# EAGLE schematic SMART_PJU (EAGLE 9.6.2)

## Sheet 1 of 2
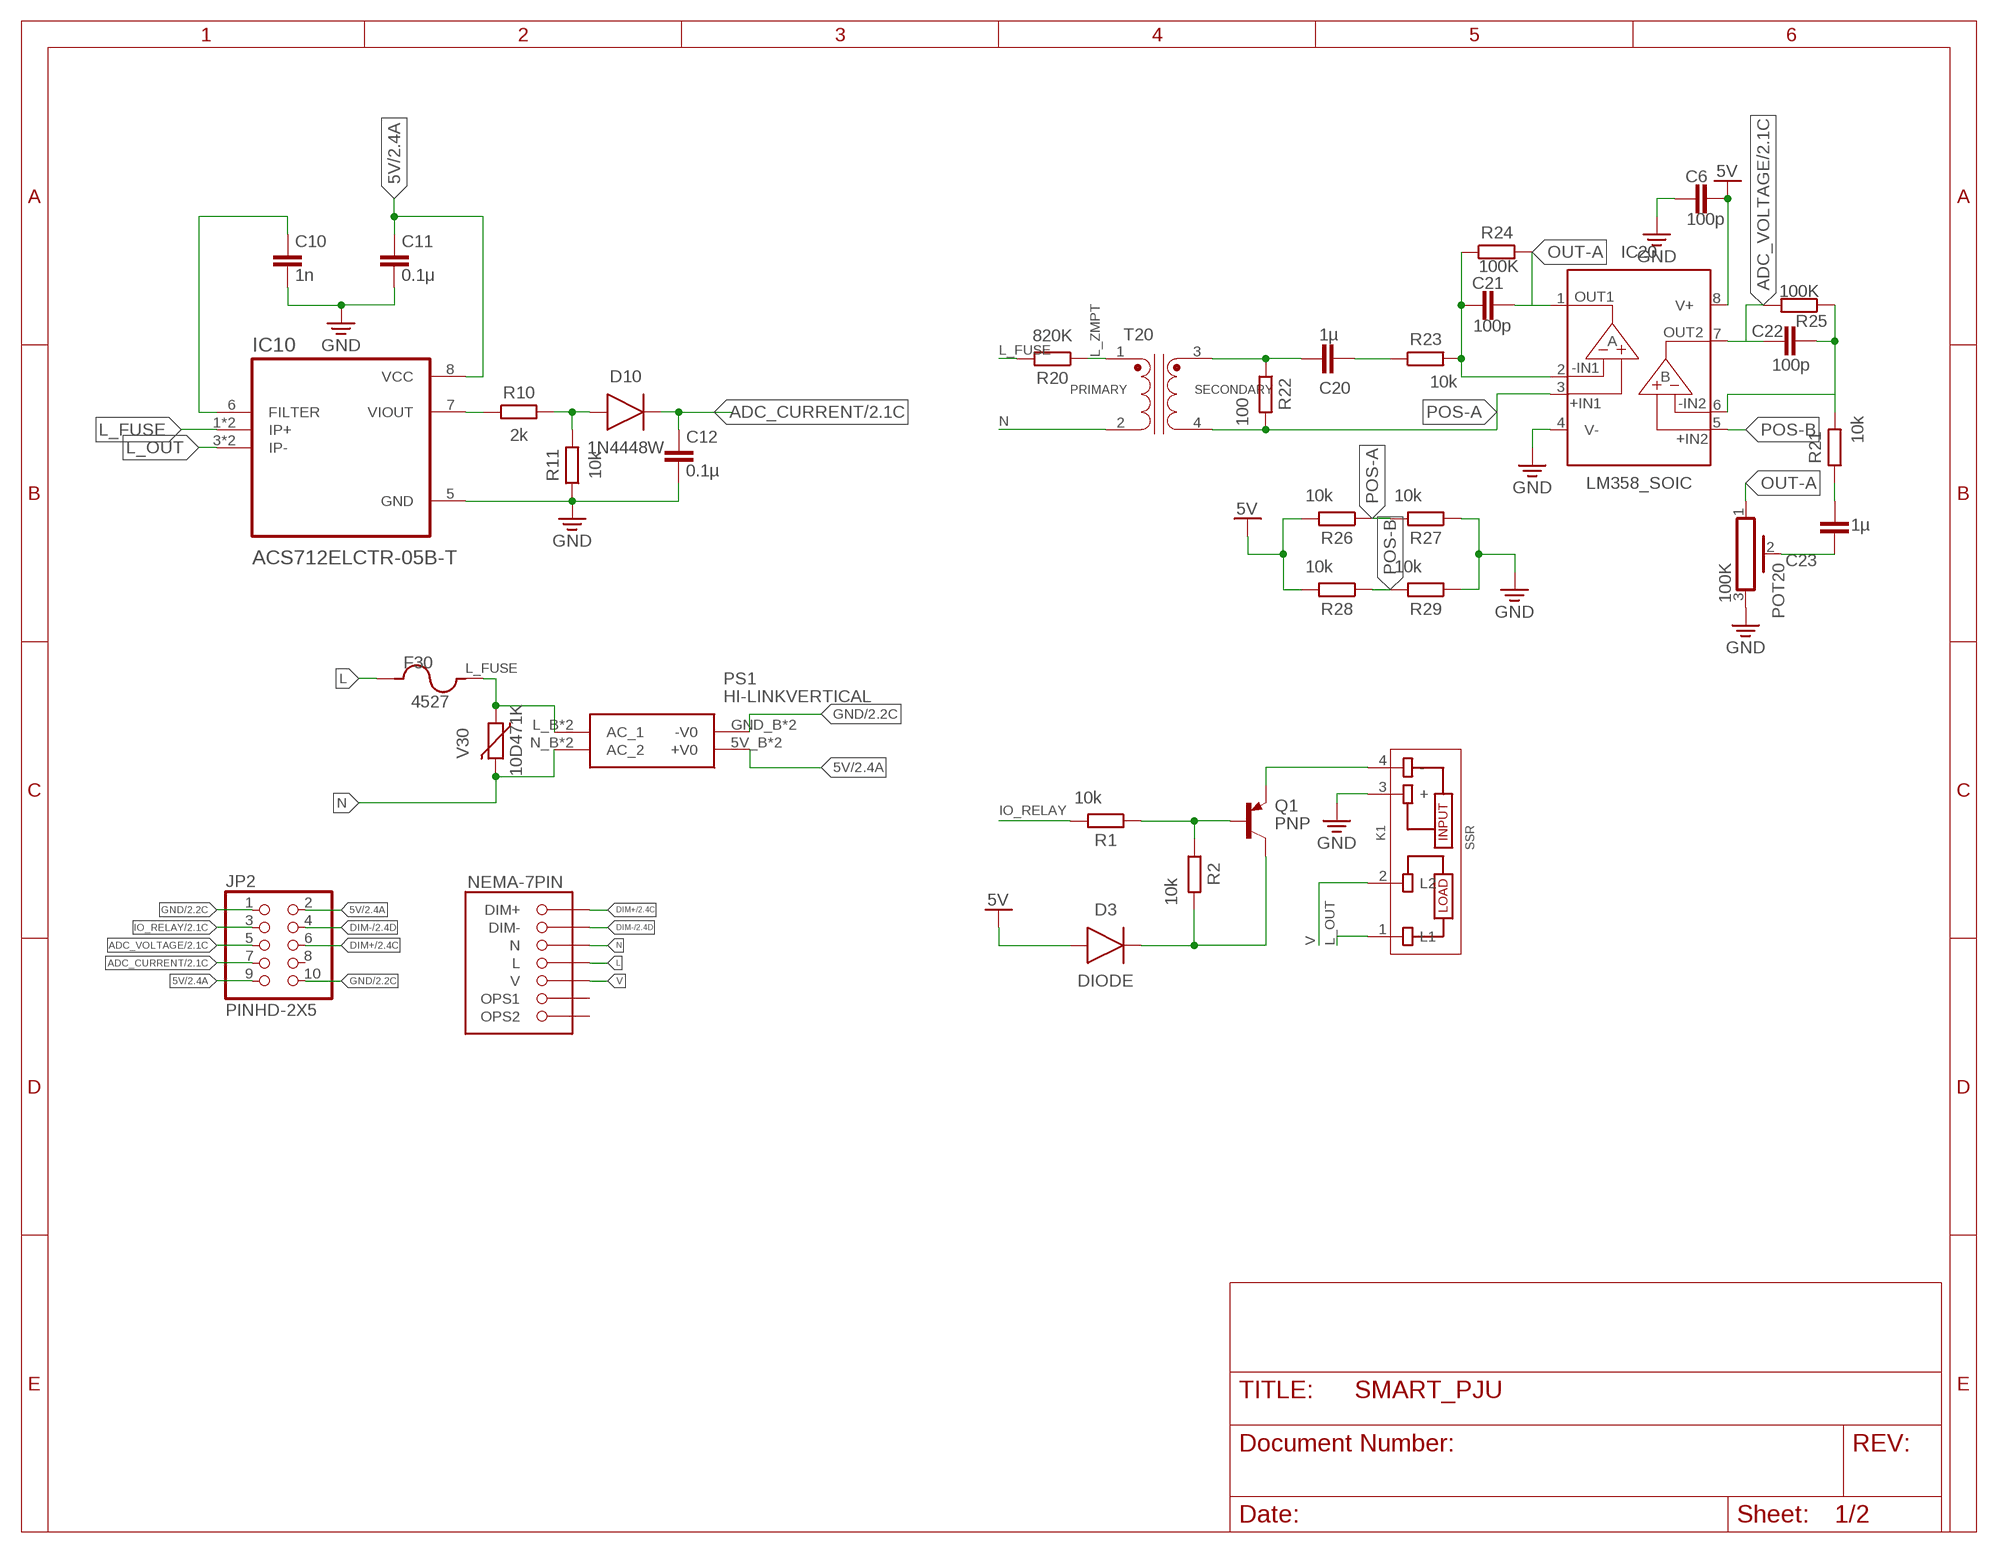
[diagram p0: schematic, sheet 1]

### Parts
C6  100p  C_CHIP-0603(1608-METRIC)  [CAPC1608X85]
C10  1n  C_CHIP-0603(1608-METRIC)  [CAPC1608X85]
C11  0.1μ  C_CHIP-0603(1608-METRIC)  [CAPC1608X85]
C12  0.1µ  C_CHIP-0603(1608-METRIC)  [CAPC1608X85]
C20  1µ  C_CHIP-0603(1608-METRIC)  [CAPC1608X85]
C21  100p  C_CHIP-0603(1608-METRIC)  [CAPC1608X85]
C22  100p  C_CHIP-0603(1608-METRIC)  [CAPC1608X85]
C23  1µ  C_CHIP-0603(1608-METRIC)  [CAPC1608X85]
D3  DIODE  DIODEDO-214AC(SMA)  [DIOM5226X290N]
D10  1N4448W  DIODE_1N4148W-7-F_SOD123G  [SOD3715X135]
F30  4527  [4527]
IC10  ACS712ELCTR-05B-T  [SOIC127P600X175-8N@1]
IC20  LM358_SOIC  [SOIC127P600X175-8N]
JP2  PINHD-2X5  [2X05]
K1  SSR  [SSR_G3MB-202P]
NEMA-7PIN  NEMA-7P  [NEMA-7P]
POT20  100K  PV36W  [PV36W]
PS1  HI-LINKVERTICAL  [AC-DC_3.5W(VER)]
Q1  PNP  PNP_SOT23-BEC  [SOT95P237X112-3N]
R1  10k  R_CHIP-0603(1608-METRIC)  [RESC1608X60]
R2  10k  R_CHIP-0603(1608-METRIC)  [RESC1608X60]
R10  2k  R_CHIP-0603(1608-METRIC)  [RESC1608X60]
R11  10k  R_CHIP-0603(1608-METRIC)  [RESC1608X60]
R20  820K  R-EU_R0805  [R0805]
R21  10k  R_CHIP-0603(1608-METRIC)  [RESC1608X60]
R22  100  R-EU_R1206  [R1206]
R23  10k  R_CHIP-0603(1608-METRIC)  [RESC1608X60]
R24  100K  R_CHIP-0603(1608-METRIC)  [RESC1608X60]
R25  100K  R_CHIP-0603(1608-METRIC)  [RESC1608X60]
R26  10k  R_CHIP-0603(1608-METRIC)  [RESC1608X60]
R27  10k  R_CHIP-0603(1608-METRIC)  [RESC1608X60]
R28  10k  R_CHIP-0603(1608-METRIC)  [RESC1608X60]
R29  10k  R_CHIP-0603(1608-METRIC)  [RESC1608X60]
T20  ZMPT101B  [ZMPT101B]
V30  10D471K  VARISTOR  [MOV-10D561]

### Nets
5V: C6.2 C11.1 D3.2(A) IC10.8(VCC) IC20.8(V+) JP2.2 JP2.9 PS1.5V_B(+V0) PS1.5V_T(+V0) R26.2 R28.2 ; also sheet 2
ADC_CURRENT: C12.1 D10.1(C) JP2.7 ; also sheet 2
ADC_VOLTAGE: JP2.5 R25.2 ; also sheet 2
DIM+: JP2.6 NEMA-7PIN.DIM+ ; also sheet 2
DIM-: JP2.4 NEMA-7PIN.DIM- ; also sheet 2
GND: C6.1 C10.2 C11.2 C12.2 IC10.5(GND) IC20.4(V-) JP2.1 JP2.10 K1.3(+) POT20.3 PS1.GND_B(-V0) PS1.GND_T(-V0) R11.1 R27.1 R29.1 ; also sheet 2
IO_RELAY: JP2.3 R1.2 ; also sheet 2
L: F30.1 NEMA-7PIN.L
L_FUSE: F30.2 IC10.1(IP+) IC10.2(IP+) PS1.L_B(AC_1) PS1.L_T(AC_1) R20.2 V30.1
L_OUT: IC10.3(IP-) IC10.4(IP-) K1.1(L1)
L_ZMPT: R20.1 T20.1
N: NEMA-7PIN.N PS1.N_B(AC_2) PS1.N_T(AC_2) T20.2 V30.2
N$1: C20.1 R22.1 T20.3
N$2: C21.2 IC20.1(OUT1)
N$3: C20.2 R23.1
N$4: IC10.7(VIOUT) R10.1
N$7: C22.1 IC20.7(OUT2)
N$8: C21.1 IC20.2(-IN1) R23.2 R24.1
N$9: D10.2(A) R10.2 R11.2
N$11: C10.1 IC10.6(FILTER)
N$12: D3.1(C) Q1.3(C) R2.2
N$13: Q1.1(B) R1.1 R2.1
N$15: K1.4(-) Q1.2(E)
N$16: C22.2 IC20.6(-IN2) R21.2 R25.1
N$17: C23.2 R21.1
N$18: C23.1 POT20.2
OUT-A: POT20.1 R24.2
POS-A: IC20.3(+IN1) R22.2 R26.1 R27.2 T20.4
POS-B: IC20.5(+IN2) R28.1 R29.2
V: K1.2(L2) NEMA-7PIN.V
Unconnected: JP2.8 NEMA-7PIN.OPS1 NEMA-7PIN.OPS2

## Sheet 2 of 2
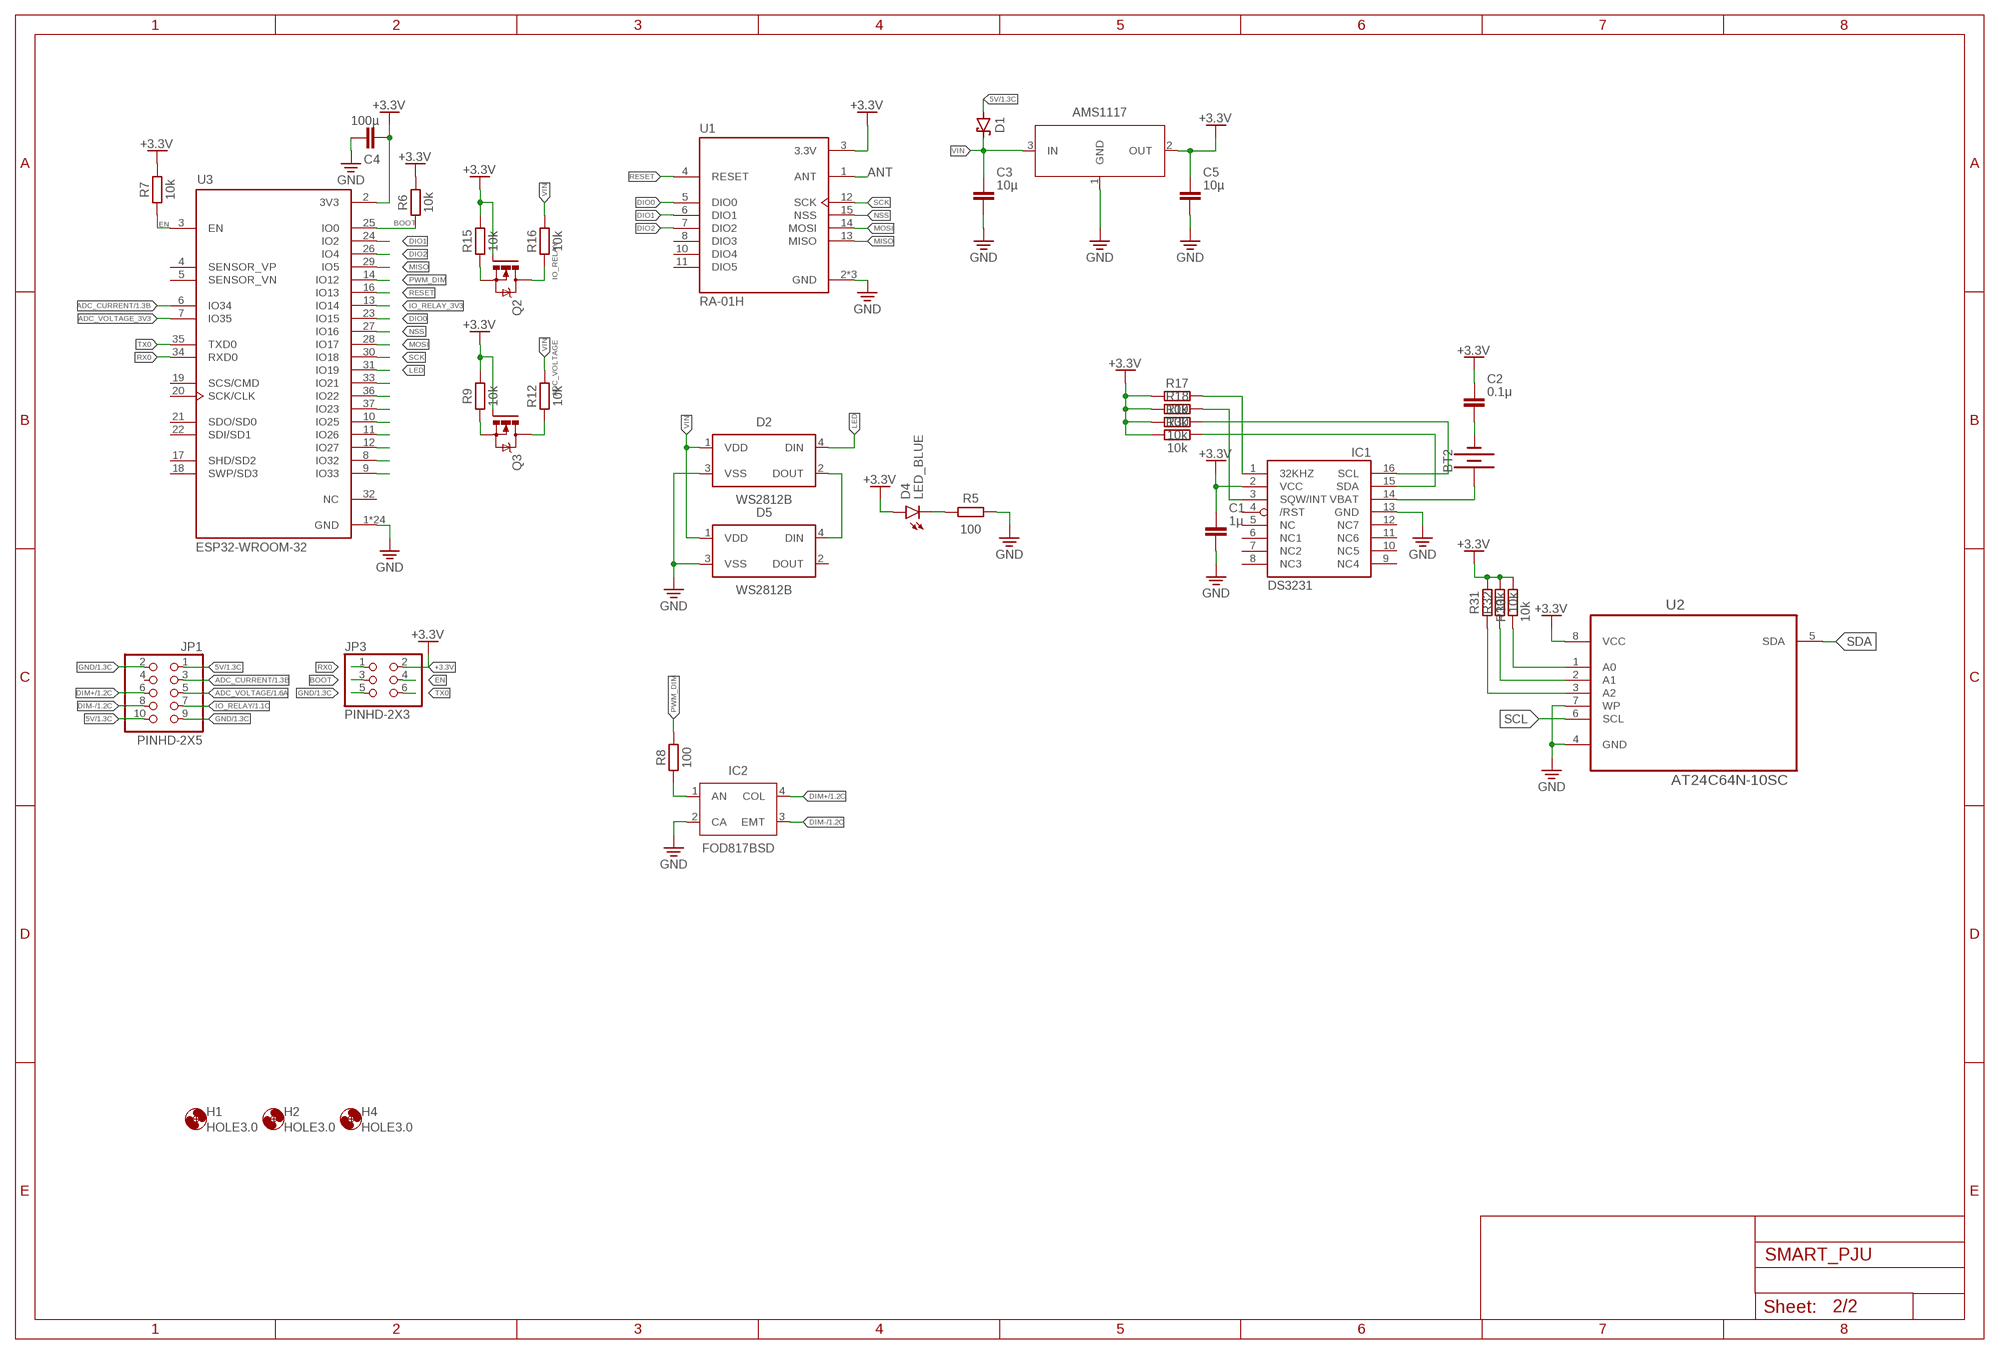
[diagram p1: schematic, sheet 2]

### Parts
AMS1117  NCP1117ST33T3G  NCP1117ST33T3GSOT-223  [SOT230P700X170-4]
BT2  BATTERY-20MM_PTH  [BATTCOM_20MM_PTH]
C1  1μ  C_CHIP-0603(1608-METRIC)  [CAPC1608X85]
C2  0.1μ  C_CHIP-0603(1608-METRIC)  [CAPC1608X85]
C3  10µ  C_CHIP-0603(1608-METRIC)  [CAPC1608X85]
C4  100µ  C_TANTALUM-2412(6032-METRIC)  [CAPM6032X280]
C5  10µ  C_CHIP-0603(1608-METRIC)  [CAPC1608X85]
D1  MBR0520LT1G  SCHOTTKY_MBR0520LT1GDO-219  [SODFL3718X115]
D2  WS2812B  [WS2812B]
D4  LED_BLUE  CHIP-FLAT-B_0603-0.55MM  [LEDC1608X55N_FLAT-B]
D5  WS2812B  [WS2812B]
H1  HOLE3.0  MOUNT-HOLE3.0  [3,0]
H2  HOLE3.0  MOUNT-HOLE3.0  [3,0]
H4  HOLE3.0  MOUNT-HOLE3.0  [3,0]
IC1  DS3231/SO  [SO16W]
IC2  FOD817BSD  FOD817BSDSMT  [DIP1016W60P279L460H460Q4B]
JP1  PINHD-2X5  [2X05]
JP3  PINHD-2X3  [2X03]
Q2  NMOSFET  NMOSFETSOT23-GSD  [SOT23]
Q3  NMOSFET  NMOSFETSOT23-GSD  [SOT23]
R5  100  R_CHIP-0603(1608-METRIC)  [RESC1608X60]
R6  10k  R_CHIP-0603(1608-METRIC)  [RESC1608X60]
R7  10k  R_CHIP-0603(1608-METRIC)  [RESC1608X60]
R8  100  R_CHIP-0603(1608-METRIC)  [RESC1608X60]
R9  10k  R_CHIP-0603(1608-METRIC)  [RESC1608X60]
R12  10k  R_CHIP-0603(1608-METRIC)  [RESC1608X60]
R15  10k  R_CHIP-0603(1608-METRIC)  [RESC1608X60]
R16  10k  R_CHIP-0603(1608-METRIC)  [RESC1608X60]
R17  10k  R-EU_R1206  [R1206]
R18  10k  R-EU_R1206  [R1206]
R19  10k  R-EU_R1206  [R1206]
R30  10k  R-EU_R1206  [R1206]
R31  10k  R-EU_R1206  [R1206]
R32  10k  R-EU_R1206  [R1206]
R33  10k  R-EU_R1206  [R1206]
U1  RA-01H  [RA-01H]
U2  AT24C64N-10SC  [SOIC127P600X175-8N]
U3  ESP32-WROOM-32  [MODULE_ESP32-WROOM-32]

### Nets
5V: D1.2(A) JP1.1 JP1.10 ; also sheet 1
+3.3V: AMS1117.2(OUT) C1.1 C2.1 C4.1 C5.1 D4.A IC1.2(VCC) JP3.2 Q2.1(G) Q3.1(G) R6.2 R7.2 R9.2 R15.2 R17.1 R18.1 R19.1 R30.1 R31.2 R32.2 R33.2 U1.3(3.3V) U2.8(VCC) U3.2(3V3)
ADC_CURRENT: JP1.3 U3.6(IO34) ; also sheet 1
ADC_VOLTAGE: JP1.5 Q3.3(D) R12.1 ; also sheet 1
ADC_VOLTAGE_3V3: Q3.2(S) R9.1 U3.7(IO35)
ANT: U1.1(ANT)
BOOT: JP3.3 R6.1 U3.25(IO0)
DIM+: IC2.4(COL) JP1.6 ; also sheet 1
DIM-: IC2.3(EMT) JP1.8 ; also sheet 1
DIO0: U1.5(DIO0) U3.23(IO15)
DIO1: U1.6(DIO1) U3.24(IO2)
DIO2: U1.7(DIO2) U3.26(IO4)
EN: JP3.4 R7.1 U3.3(EN)
GND: C1.2 C3.2 C4.2 C5.2 D2.3(VSS) D5.3(VSS) IC1.13(GND) IC2.2(CA) JP1.2 JP1.9 JP3.5 R5.2 U1.2(GND) U1.9(GND) U1.16(GND) U2.4(GND) U2.7(WP) U3.1(GND) U3.15(GND) U3.38(GND) U3.39_1(GND) U3.39_2(GND) U3.39_3(GND) U3.39_4(GND) U3.39_5(GND) U3.39_6(GND) U3.39_7(GND) U3.39_8(GND) U3.39_9(GND) U3.39_10(GND) U3.39_11(GND) U3.39_12(GND) U3.39_13(GND) U3.39_14(GND) U3.39_15(GND) U3.39_16(GND) U3.39_17(GND) U3.39_18(GND) U3.39_19(GND) U3.39_20(GND) U3.39_21(GND) ; also sheet 1
IO_RELAY: JP1.7 Q2.3(D) R16.1 ; also sheet 1
IO_RELAY_3V3: Q2.2(S) R15.1 U3.13(IO14)
LED: D2.4(DIN) U3.31(IO19)
MISO: U1.13(MISO) U3.29(IO5)
MOSI: U1.14(MOSI) U3.28(IO17)
N$5: R33.1 U2.1(A0)
N$6: R32.1 U2.2(A1)
N$10: R31.1 U2.3(A2)
N$14: D2.2(DOUT) D5.4(DIN)
N$19: BT2.1(+) IC1.14(VBAT)
N$20: IC1.3(SQW/INT) R18.2
N$21: IC1.1(32KHZ) R17.2
N$23: BT2.2(-) C2.2
N$25: D4.C R5.1
N$26: IC2.1(AN) R8.1
N$33: AMS1117.1(GND) ; supply symbol labelled GND
N$39: U3.33(IO21)
N$40: U3.36(IO22)
N$41: U3.37(IO23)
N$42: U3.10(IO25)
N$43: U3.11(IO26)
N$44: U3.12(IO27)
N$45: U3.8(IO32)
N$46: U3.9(IO33)
NSS: U1.15(NSS) U3.27(IO16)
PWM_DIM: R8.2 U3.14(IO12)
RESET: U1.4(RESET) U3.16(IO13)
RX0: JP3.1 U3.34(RXD0)
SCK: U1.12(SCK) U3.30(IO18)
SCL: IC1.16(SCL) R19.2 U2.6(SCL)
SDA: IC1.15(SDA) R30.2 U2.5(SDA)
TX0: JP3.6 U3.35(TXD0)
VIN: AMS1117.3(IN) C3.1 D1.1(C) D2.1(VDD) D5.1(VDD) R12.2 R16.2
Unconnected: D5.2(DOUT) IC1.4(/RST) IC1.5(NC) IC1.6(NC1) IC1.7(NC2) IC1.8(NC3) IC1.9(NC4) IC1.10(NC5) IC1.11(NC6) IC1.12(NC7) JP1.4 U1.8(DIO3) U1.10(DIO4) U1.11(DIO5) U3.4(SENSOR_VP) U3.5(SENSOR_VN) U3.17(SHD/SD2) U3.18(SWP/SD3) U3.19(SCS/CMD) U3.20(SCK/CLK) U3.21(SDO/SD0) U3.22(SDI/SD1) U3.32(NC)

## Library data of the parts
AMS1117 = IC_Power-Management:NCP1117ST33T3G: 1.0 A Low-Dropout Positive Fixed and Adjustable Voltage Regulators Datasheet <https://www.onsemi.com/pub/Collateral/NCP1117-D.PDF>; CATEGORY: IC_Power-Management; MANUFACTURER: ON Semiconductor; MPN: NCP1117ST33T3G; OPERATING_TEMP: 0 to +125 °C; PART_STATUS: Active; ROHS_COMPLIANT: RoHS3 Compliant; SERIES: NCP1117, NCV1117; SUB-CATEGORY: Voltage Regulator; TYPE: Linear
BT2 = SparkFun-Batteries:BATTERY: Battery - Single Cell A variety of battery chemistries, sizes, and footprints. Device List: 20MM_PTH - Coin Cell Battery Holder - 20mm (PTH) <https://www.sparkfun.com/products/783> 20MM_PTH_KIT- Coin Cell battery Holder - 20 mm (PTH) <http://www.sparkfun.com/products/783>kit version with special mask 6.8MM_PTH - Coin Cell Battery Holder - 6.8MM(SMD) <https://www.digikey.com/product-detail/en/seiko-instruments/MS621FE-FL11E/728-1057-ND/1889208?WT.srch=1&gclid=CNOQ5a6LzdQCFZS2wAodXCkE0g> 12MM_SMD - Coin Cell Battery Holder - 12mm (SMD) <https://www.sparkfun.com/products/10592> 12MM_PTH - Coin Cell Battery Holder - 12mm (PTH) <https://www.sparkfun.com/products/7948> 20MM_SMD - 20mm Coin Cell Battery Holder (SMD) (2 legs) Used on the Big Time Watch Kit <https://www.sparkfun.com/products/11734> 20MM_SMD_4LEGS - Coin Cell Battery Holder - 20mm (SMD) <https://www.sparkfun.com/products/11892> 20MM_SMD_4LEGS_OVERPASTE - Coin Cell Battery Holder - 20mm (SMD) <https://www.sparkfun.com/products/11892> (Over-paste on the legs) 24.5MM_PTH - Coin Cell Battery Holder - 24.5mm (PTH) <https://www.sparkfun.com/products/8863> 9V - 9V Battery Holder - PC Mount Used on the SparkFun SparkPunk Sound Kit <https://www.sparkfun.com/products/11177> and SparkFun SparkPunk Sequencer Kit <https://www.sparkfun.com/products/12707> 18650 - Battery Holder - 18650 (PTH) <https://www.sparkfun.com/products/13113> AA - Battery Holder - 1xAA (PTH) <https://www.sparkfun.com/products/7949> AAA - Battery Holder - 1xAAA (PTH) <https://www.sparkfun.com/products/12718> AA_KIT - Battery Holder - 1xAA (PTH) <https://www.sparkfun.com/products/7949> Special kit package - pads only have exposed copper on one side of the board. AAA_KIT - Battery Holder - 1xAAA (PTH) <https://www.sparkfun.com/products/12718> Special kit package - pads only have exposed copper on one side of the board.; PROD_ID: BATT-09031; SF_SKU: PRT-00783
C1-C6 C10-C12 C20-C23 = Capacitor:C: Capacitor - Generic; CATEGORY: Capacitor
D1 = Diode:SCHOTTKY_: Schottky Diode - Popular parts; CATEGORY: Diode; DESCRIPTION: DIODE SCHOTTKY 20V 500MA SOD123; MANUFACTURER: ON Semiconductor; MPN: MBR0520LT1G; SUB-CATEGORY: Schottky
D2 D5 = LED:WS2812B: Intelligent control LED integrated light source Datasheet <http://cdn.sparkfun.com/datasheets/BreakoutBoards/WS2812B.pdf>; CATEGORY: LED; COLOR: RGB; DESCRIPTION: LED integrated light source; MANUFACTURER: Worldsemi; MPN: WS2812B; OPERATING_TEMP: -25 ℃ to +80℃(TJ); PART_STATUS: Active; SUB_CATEGORY: RGB
D3 = Diode:DIODE: Diode Rectifier - Generic; CATEGORY: Diode; SUB-CATEGORY: Rectifier
D4 = LED:CHIP-FLAT-B; CATEGORY: LED; COLOR: BLUE; DESCRIPTION: CHIP LED FLAT; SUB-CATEGORY: CHIP; TYPE: FLAT_TOP
D10 = Diode:DIODE_: Diode Rectifier - Popular parts; CATEGORY: Diode; DESCRIPTION: DIODE GEN PURP 100V 300MA SOD123; MANUFACTURER: Diodes Incorporated; SUB-CATEGORY: Rectifier; VALUE: 1N4148W
F30 = Fuse Holder:4527: FUSE HLDR CARTRIDGE 250V 5A PCB Manufacturer's datasheet <https://www.keyelco.com/userAssets/file/M65p44.pdf>; CREATED_BY: PCBLayout.com; DIGIKEY_PN: 36-4527-ND; MANUFACTURER: Keystone Electronics; MPN: 4527
H1 H2 H4 = holes:MOUNT-HOLE: MOUNTING HOLE with drill center marker
IC1 = XLKM#4:DS3231
IC2 = Opto-Electronic:FOD817BSD: 4-Pin DIP Phototransistor Optocouplers; CATEGORY: Opto-Electronic; MANUFACTURER: ON Semiconductor; MPN: FOD817BSD; OPERATING_TEMP: -55 to +110 °C; PART_STATUS: Active; ROHS_COMPLIANT: RoHS3 Compliant; SUB-CATEGORY: OptoCoupler; THERMALLOSS: 0.2W
IC10 = XLKM#4:ACS712ELCTR-05B-T
IC20 = IC_Linear:LM358: Dual Operational Amplifier Reference Datasheet <https://www.ti.com/lit/ds/symlink/lm158-n.pdf>; CATEGORY: Amplifier; DESCRIPTION: Dual Operational Amplifier; MANUFACTURER: Generic; MPN: Generic; SERIES: LM358; SUB-CATEGORY: OpAmp; TYPE: Dual
JP1 JP2 = Connector:PINHD-2X5: PIN HEADER; CATEGORY: CONNECTOR; SUB-CATEGORY: PIN-HEADER
JP3 = Connector:PINHD-2X3: PIN HEADER; CATEGORY: CONNECTOR; SUB-CATEGORY: PIN-HEADER
K1 = XLKM#4:SSR: Relay 12vdc Isolation Photot; MANUFACTURER: Omron; PARTREV: N/A; STANDARD: Manufacturer Recommendation
NEMA-7PIN = XLKM#4:NEMA-7P
POT20 = Resistor:PV36: Rectangular Trimmer Potentiometers - PV36 Series Datasheet <https://www.bourns.com/docs/Product-Datasheets/pv36.pdf>; CATEGORY: Resistor; DESCRIPTION: Lead Sealed Type Multiturn PV36 Series; MANUFACTURER: BOURNS; MPN: PV36W; OPERATING_TEMPERATURE: -55 to +125 °C; PART_STATUS: Active; ROHS_COMPLIANCE: RoHS Compliant; SERIES: PV36; SUB-CATEGORY: Trimpot; TYPE: Lead Sealed
PS1 = XLKM#4:HI-LINK: HI-LINK HLK-10M05 Manufacturer : HI-LINK <https://lcsc.com//brand-detail/11515.html> Mfr.Part # HLK-10M05 LCSC Part # C403745 <https://lcsc.com/product-detail/show_C403745.html> Package : Through Hole Datasheet :  EasyEDA Model <javascript:void(0);> Power Module AC-DC Through Hole RoHS Source: Datasheet <https://datasheet.lcsc.com/szlcsc/1909111105_HI-LINK-HLK-10M05_C403745.pdf>
Q1 = Transistor:PNP: PNP - Generic; CATEGORY: Transistor; SUB-CATEGORY: BJT; TYPE: PNP
Q2 Q3 = Transistor:NMOSFET: N-Channel MOSFET - Generic; CATEGORY: Transistor; SUB-CATEGORY: MOSFET; TYPE: N-Channel
R1 R2 R5-R12 R15 R16 R21 R23-R29 = Resistor:R: Resistor Fixed - Generic; CATEGORY: Resistor; SUB-CATEGORY: Fixed
R17-R20 R22 R30-R33 = rcl:R-EU_: RESISTOR, European symbol; SPICEPREFIX: R
T20 = XLKM#4:ZMPT101B: Current-type Voltage Transformer; MANUFACTURER: Qingxian Zeming Langxi Electronic; MAXIMUM_PACKAGE_HEIGHT: 18.8mm; PARTREV: NA; STANDARD: Manufacturer Recommendations
U1 = XLKM#4:RA-01H: Ai-Thinker Lora Series Module; MANUFACTURER: AI-Thinker; MAXIMUM_PACKAGE_HEIGHT: 3.4mm; PARTREV: V1.0; STANDARD: Manufacturer Recommendations
U2 = XLKM#4:AT24C64N-10SC: Two-wire Serial EEPROM; MPN: AT24C64N-10SC; OC_FARNELL: 1362658; OC_NEWARK: -; PACKAGE: SOIC-8; SUPPLIER: Atmel
U3 = XLKM#4:ESP32-WROOM-32; MANUFACTURER: Espressif Systems; MAXIMUM_PACKAGE_HEIGHT: 3.2 mm; PARTREV: 2.9; STANDARD: Manufacturer Recommendations
V30 = XLKM#4:VARISTOR